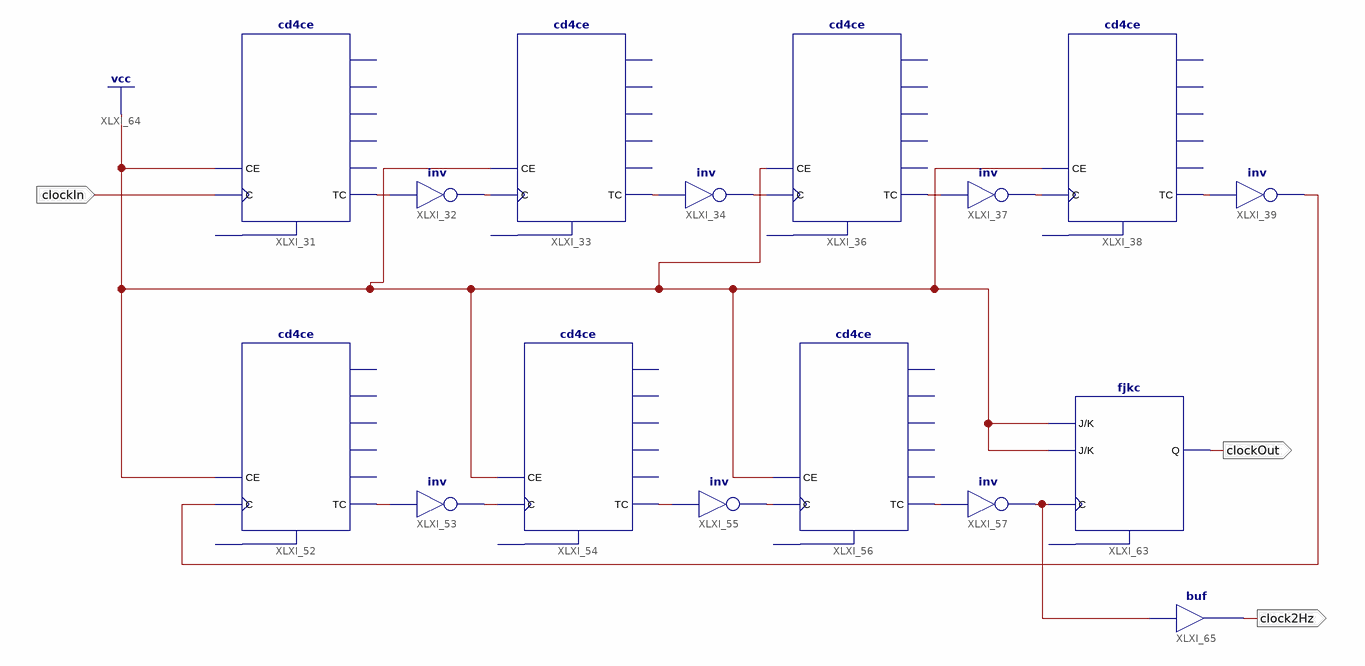
[diagram p0: schematic sheet 1]
// Xilinx ISE schematic frequencyDivider.sch (spartan6) as structural Verilog: 16 symbols, 3 ports
module frequencyDivider (
  input  clockIn,
  output clockOut,
  output clock2Hz
);

  wire XLXN_43, XLXN_44, XLXN_49, XLXN_50, XLXN_52, XLXN_53, XLXN_54, XLXN_72, XLXN_73, XLXN_74, XLXN_75,
       XLXN_88, XLXN_101, XLXN_102;

  cd4ce XLXI_31 (.C(clockIn), .CE(1'b1), .TC(XLXN_43));  // open: CLR, CEO, Q0, Q1, Q2, Q3
  not XLXI_32 (XLXN_49, XLXN_43);
  cd4ce XLXI_33 (.C(XLXN_49), .CE(1'b1), .TC(XLXN_44));  // open: CLR, CEO, Q0, Q1, Q2, Q3
  not XLXI_34 (XLXN_50, XLXN_44);
  cd4ce XLXI_36 (.C(XLXN_50), .CE(1'b1), .TC(XLXN_52));  // open: CLR, CEO, Q0, Q1, Q2, Q3
  not XLXI_37 (XLXN_54, XLXN_52);
  cd4ce XLXI_38 (.C(XLXN_54), .CE(1'b1), .TC(XLXN_53));  // open: CLR, CEO, Q0, Q1, Q2, Q3
  not XLXI_39 (XLXN_101, XLXN_53);
  cd4ce XLXI_52 (.C(XLXN_101), .CE(1'b1), .TC(XLXN_88));  // open: CLR, CEO, Q0, Q1, Q2, Q3
  not XLXI_53 (XLXN_72, XLXN_88);
  cd4ce XLXI_54 (.C(XLXN_72), .CE(1'b1), .TC(XLXN_73));  // open: CLR, CEO, Q0, Q1, Q2, Q3
  not XLXI_55 (XLXN_75, XLXN_73);
  cd4ce XLXI_56 (.C(XLXN_75), .CE(1'b1), .TC(XLXN_74));  // open: CLR, CEO, Q0, Q1, Q2, Q3
  not XLXI_57 (XLXN_102, XLXN_74);
  fjkc XLXI_63 (.C(XLXN_102), .J(1'b1), .K(1'b1), .Q(clockOut));  // open: CLR
  buf XLXI_65 (clock2Hz, XLXN_102);
endmodule
